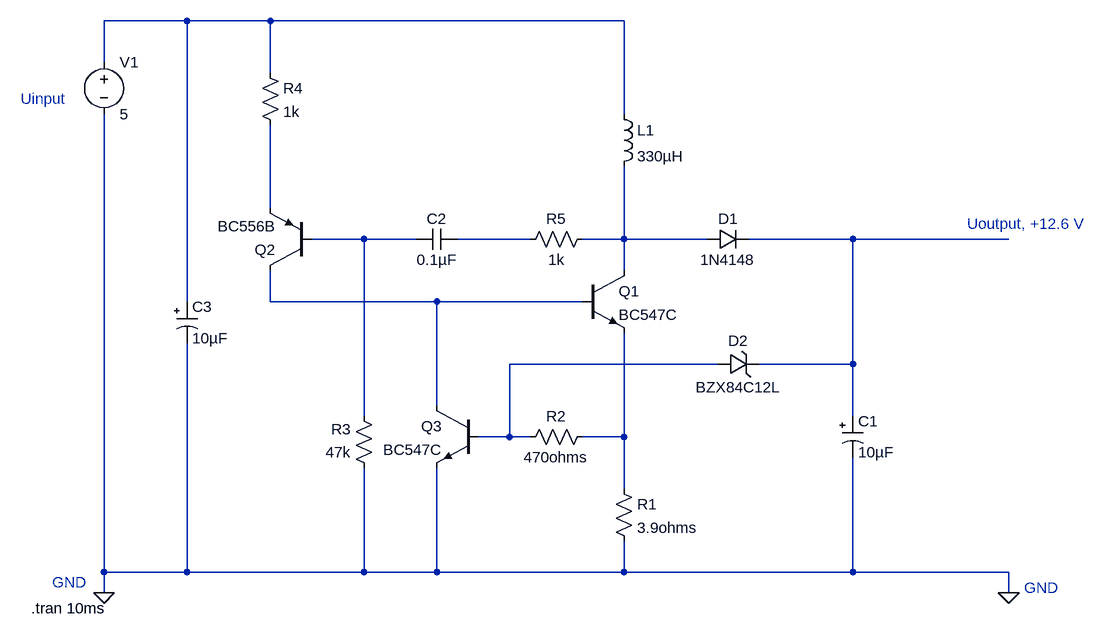
[diagram p0: schematic kursach (2).asc]
kursach (2).asc, the LTspice schematic file:
Version 4
SHEET 1 1336 680
WIRE -64 -256 -192 -256
WIRE 64 -256 -64 -256
WIRE 608 -256 64 -256
WIRE -192 -192 -192 -256
WIRE 64 -176 64 -256
WIRE 608 -112 608 -256
WIRE 64 32 64 -96
WIRE 208 80 128 80
WIRE 288 80 208 80
WIRE 464 80 352 80
WIRE 608 80 608 -32
WIRE 608 80 544 80
WIRE 736 80 608 80
WIRE 960 80 800 80
WIRE 1200 80 960 80
WIRE 608 128 608 80
WIRE -64 176 -64 -256
WIRE 64 176 64 128
WIRE 320 176 64 176
WIRE 544 176 320 176
WIRE 752 272 432 272
WIRE 960 272 960 80
WIRE 960 272 816 272
WIRE 320 336 320 176
WIRE 208 352 208 80
WIRE 960 352 960 272
WIRE 432 384 432 272
WIRE 432 384 384 384
WIRE 464 384 432 384
WIRE 608 384 608 224
WIRE 608 384 544 384
WIRE 608 464 608 384
WIRE -192 592 -192 -112
WIRE -64 592 -64 240
WIRE -64 592 -192 592
WIRE 208 592 208 432
WIRE 208 592 -64 592
WIRE 320 592 320 432
WIRE 320 592 208 592
WIRE 608 592 608 544
WIRE 608 592 320 592
WIRE 960 592 960 416
WIRE 960 592 608 592
WIRE 1200 592 960 592
WIRE -192 624 -192 592
WIRE 1200 624 1200 592
FLAG -192 624 0
FLAG 1200 624 0
SYMBOL cap 352 64 R90
WINDOW 0 0 32 VBottom 2
WINDOW 3 32 32 VTop 2
SYMATTR InstName C2
SYMATTR Value 0.1µF
SYMBOL res 592 448 R0
SYMATTR InstName R1
SYMATTR Value 3.9ohms
SYMBOL res 560 368 R90
WINDOW 0 0 56 VBottom 2
WINDOW 3 32 56 VTop 2
SYMATTR InstName R2
SYMATTR Value 470ohms
SYMBOL res 224 448 R180
WINDOW 0 36 76 Left 2
WINDOW 3 36 40 Left 2
SYMATTR InstName R3
SYMATTR Value 47k
SYMBOL res 48 -192 R0
SYMATTR InstName R4
SYMATTR Value 1k
SYMBOL res 560 64 R90
WINDOW 0 0 56 VBottom 2
WINDOW 3 32 56 VTop 2
SYMATTR InstName R5
SYMATTR Value 1k
SYMBOL ind 592 -128 R0
SYMATTR InstName L1
SYMATTR Value 330µH
SYMBOL diode 736 96 R270
WINDOW 0 32 32 VTop 2
WINDOW 3 0 32 VBottom 2
SYMATTR InstName D1
SYMATTR Value 1N4148
SYMBOL voltage -192 -208 R0
SYMATTR InstName V1
SYMATTR Value 5
SYMBOL polcap 944 352 R0
SYMATTR InstName C1
SYMATTR Value 10µF
SYMBOL polcap -80 176 R0
SYMATTR InstName C3
SYMATTR Value 10µF
SYMBOL npn 544 128 R0
SYMATTR InstName Q1
SYMATTR Value BC547C
SYMBOL npn 384 336 M0
SYMATTR InstName Q3
SYMATTR Value BC547C
SYMBOL pnp 128 128 R180
SYMATTR InstName Q2
SYMATTR Value BC556B
SYMBOL zener 752 288 R270
WINDOW 0 36 32 VTop 2
WINDOW 3 -4 32 VBottom 2
SYMATTR InstName D2
SYMATTR Value BZX84C12L
TEXT -304 648 Left 2 !.tran 10ms
TEXT 1136 56 Left 2 ;Uoutput, +12.6 V
TEXT 1224 616 Left 2 ;GND
TEXT -272 608 Left 2 ;GND
TEXT -320 -136 Left 2 ;Uinput

The netlist it stands for:
* kursach (2).asc
C2 N004 N003 0.1µF
R1 N009 0 3.9ohms
R2 N009 N008 470ohms
R3 0 N003 47k
R4 N001 N002 1k
R5 N005 N004 1k
L1 N001 N005 330µH
D1 N005 N006 1N4148
V1 N001 0 5
C1 N006 0 10µF
C3 N001 0 10µF
Q1 N005 N007 N009 0 BC547C
Q3 N007 N008 0 0 BC547C
Q2 N007 N003 N002 0 BC556B
D2 N008 N006 BZX84C12L
.model D D
.lib standard.dio
.model NPN NPN
.model PNP PNP
.lib standard.bjt
.tran 10ms
* Uoutput, +12.6 V
* GND
* GND
* Uinput
.backanno
.end